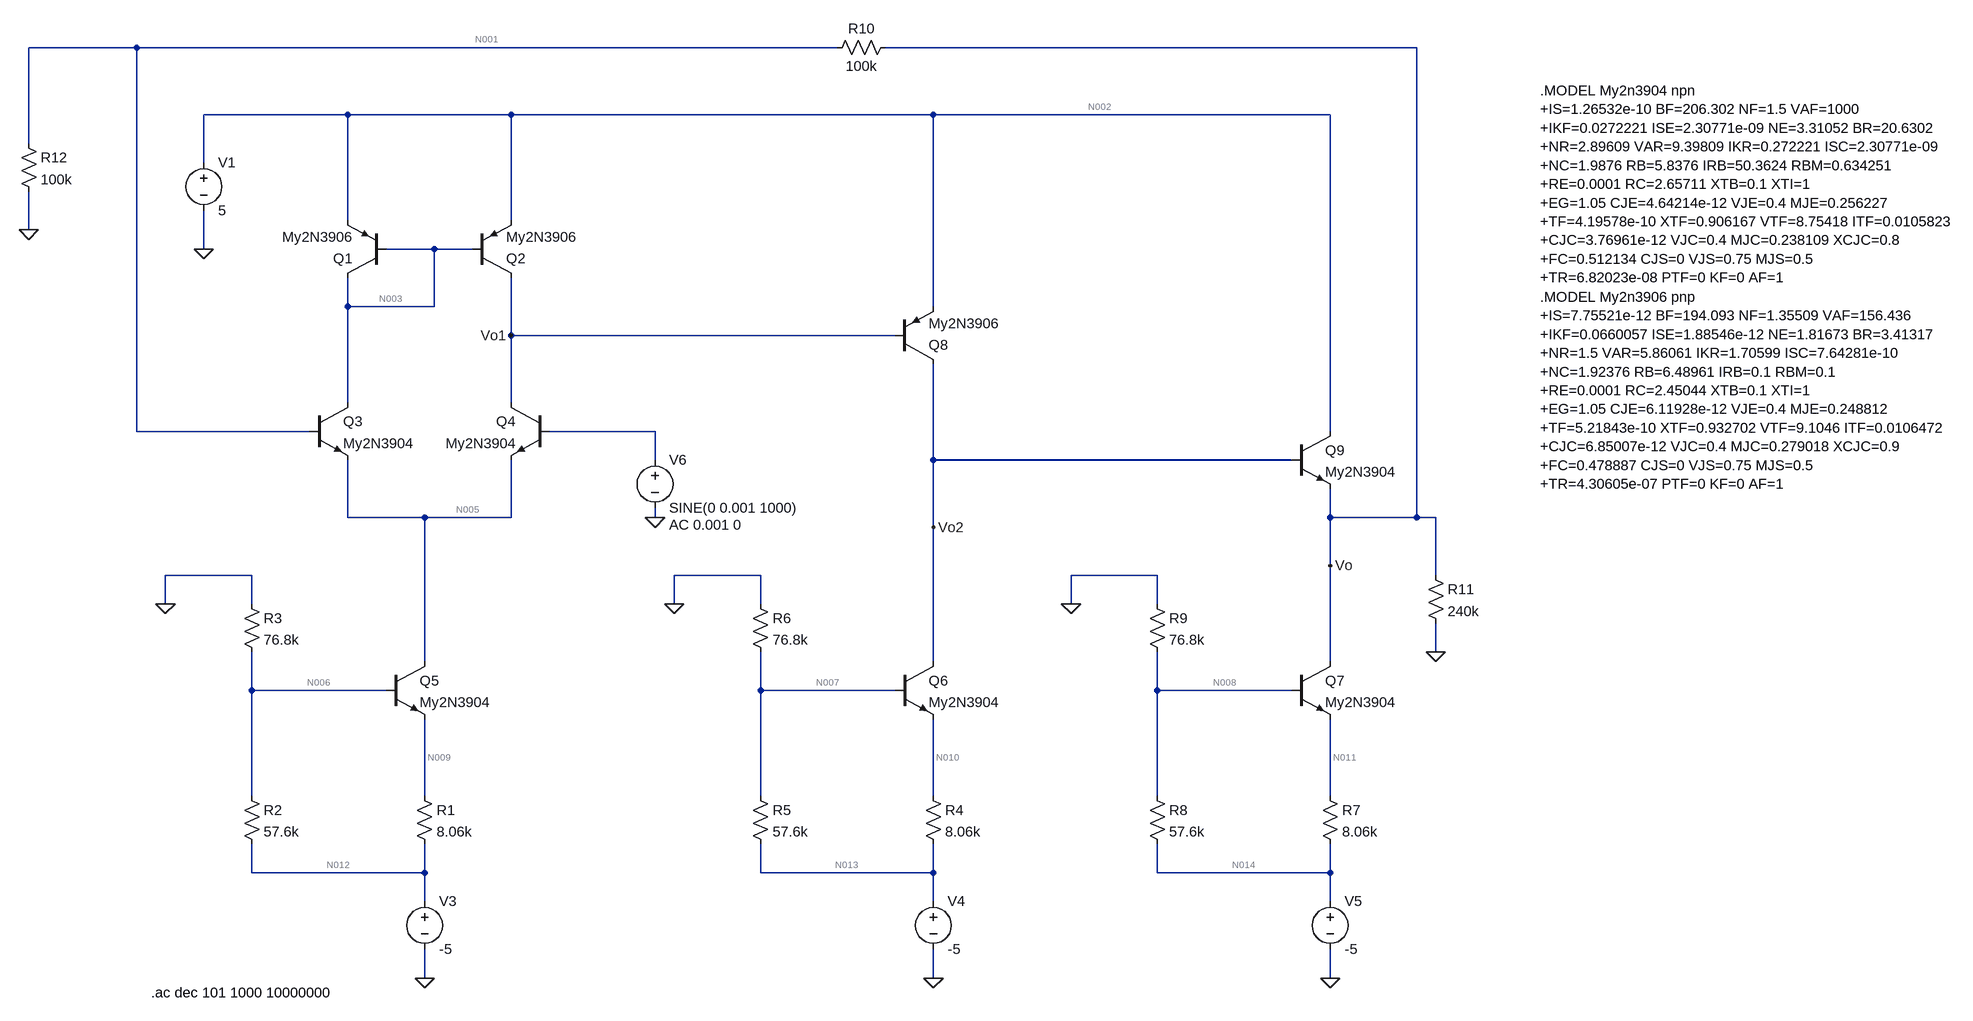
[diagram p0: schematic B.asc]
B.asc, the LTspice schematic file:
Version 4
SHEET 1 1872 872
WIRE -1376 -720 -1584 -720
WIRE -208 -720 -1376 -720
WIRE 864 -720 -128 -720
WIRE -1024 -608 -1264 -608
WIRE -752 -608 -1024 -608
WIRE -48 -608 -752 -608
WIRE 720 -608 -48 -608
WIRE -1584 -560 -1584 -720
WIRE -1264 -528 -1264 -608
WIRE -1024 -432 -1024 -608
WIRE -752 -432 -752 -608
WIRE -1584 -416 -1584 -480
WIRE -1264 -384 -1264 -448
WIRE -880 -384 -960 -384
WIRE -816 -384 -880 -384
WIRE -1024 -288 -1024 -336
WIRE -880 -288 -880 -384
WIRE -880 -288 -1024 -288
WIRE -48 -288 -48 -608
WIRE -752 -240 -752 -336
WIRE -112 -240 -752 -240
WIRE -1024 -128 -1024 -288
WIRE -752 -128 -752 -240
WIRE -1376 -80 -1376 -720
WIRE -1088 -80 -1376 -80
WIRE -512 -80 -688 -80
WIRE 720 -80 720 -608
WIRE -512 -32 -512 -80
WIRE -48 -32 -48 -192
WIRE 656 -32 -48 -32
WIRE -1024 64 -1024 -32
WIRE -896 64 -1024 64
WIRE -752 64 -752 -32
WIRE -752 64 -896 64
WIRE -512 64 -512 48
WIRE 720 64 720 16
WIRE 864 64 864 -720
WIRE 864 64 720 64
WIRE 896 64 864 64
WIRE -48 80 -48 -32
WIRE 720 144 720 64
WIRE -1184 160 -1328 160
WIRE -336 160 -480 160
WIRE 432 160 288 160
WIRE 896 160 896 64
WIRE -1328 208 -1328 160
WIRE -1184 208 -1184 160
WIRE -480 208 -480 160
WIRE -336 208 -336 160
WIRE 288 208 288 160
WIRE 432 208 432 160
WIRE 896 288 896 240
WIRE -896 304 -896 64
WIRE -48 304 -48 80
WIRE 720 304 720 144
WIRE -1184 352 -1184 288
WIRE -960 352 -1184 352
WIRE -336 352 -336 288
WIRE -112 352 -336 352
WIRE 432 352 432 288
WIRE 656 352 432 352
WIRE -1184 528 -1184 352
WIRE -896 528 -896 400
WIRE -336 528 -336 352
WIRE -48 528 -48 400
WIRE 432 528 432 352
WIRE 720 528 720 400
WIRE -1184 656 -1184 608
WIRE -896 656 -896 608
WIRE -896 656 -1184 656
WIRE -336 656 -336 608
WIRE -48 656 -48 608
WIRE -48 656 -336 656
WIRE 432 656 432 608
WIRE 720 656 720 608
WIRE 720 656 432 656
WIRE -896 704 -896 656
WIRE -48 704 -48 656
WIRE 720 704 720 656
WIRE -896 832 -896 784
WIRE -48 832 -48 784
WIRE 720 832 720 784
FLAG -1264 -384 0
FLAG -1328 208 0
FLAG -896 832 0
FLAG -480 208 0
FLAG -48 832 0
FLAG 288 208 0
FLAG 720 832 0
FLAG -512 64 0
FLAG 896 288 0
FLAG -752 -240 Vo1
FLAG -48 80 Vo2
FLAG 720 144 Vo
FLAG -1584 -416 0
SYMBOL voltage -1264 -544 R0
WINDOW 123 0 0 Left 0
WINDOW 39 0 0 Left 0
SYMATTR InstName V1
SYMATTR Value 5
SYMBOL pnp -960 -336 R180
SYMATTR InstName Q1
SYMATTR Value My2N3906
SYMBOL pnp -816 -336 M180
SYMATTR InstName Q2
SYMATTR Value My2N3906
SYMBOL npn -1088 -128 R0
SYMATTR InstName Q3
SYMATTR Value My2N3904
SYMBOL npn -688 -128 M0
SYMATTR InstName Q4
SYMATTR Value My2N3904
SYMBOL npn -960 304 R0
SYMATTR InstName Q5
SYMATTR Value My2N3904
SYMBOL res -912 512 R0
SYMATTR InstName R1
SYMATTR Value 8.06k
SYMBOL res -1200 512 R0
SYMATTR InstName R2
SYMATTR Value 57.6k
SYMBOL res -1200 192 R0
SYMATTR InstName R3
SYMATTR Value 76.8k
SYMBOL voltage -896 688 R0
WINDOW 123 0 0 Left 0
WINDOW 39 0 0 Left 0
SYMATTR InstName V3
SYMATTR Value -5
SYMBOL npn -112 304 R0
SYMATTR InstName Q6
SYMATTR Value My2N3904
SYMBOL res -64 512 R0
SYMATTR InstName R4
SYMATTR Value 8.06k
SYMBOL res -352 512 R0
SYMATTR InstName R5
SYMATTR Value 57.6k
SYMBOL res -352 192 R0
SYMATTR InstName R6
SYMATTR Value 76.8k
SYMBOL voltage -48 688 R0
WINDOW 123 0 0 Left 0
WINDOW 39 0 0 Left 0
SYMATTR InstName V4
SYMATTR Value -5
SYMBOL npn 656 304 R0
SYMATTR InstName Q7
SYMATTR Value My2N3904
SYMBOL res 704 512 R0
SYMATTR InstName R7
SYMATTR Value 8.06k
SYMBOL res 416 512 R0
SYMATTR InstName R8
SYMATTR Value 57.6k
SYMBOL res 416 192 R0
SYMATTR InstName R9
SYMATTR Value 76.8k
SYMBOL voltage 720 688 R0
WINDOW 123 0 0 Left 0
WINDOW 39 0 0 Left 0
SYMATTR InstName V5
SYMATTR Value -5
SYMBOL voltage -512 -48 R0
WINDOW 123 24 124 Left 2
WINDOW 39 0 0 Left 0
SYMATTR Value2 AC 0.001 0
SYMATTR InstName V6
SYMATTR Value SINE(0 0.001 1000)
SYMBOL pnp -112 -192 M180
SYMATTR InstName Q8
SYMATTR Value My2N3906
SYMBOL npn 656 -80 R0
SYMATTR InstName Q9
SYMATTR Value My2N3904
SYMBOL res -112 -736 R90
WINDOW 0 0 56 VBottom 2
WINDOW 3 32 56 VTop 2
SYMATTR InstName R10
SYMATTR Value 100k
SYMBOL res 880 144 R0
SYMATTR InstName R11
SYMATTR Value 240k
SYMBOL res -1600 -576 R0
SYMATTR InstName R12
SYMATTR Value 100k
TEXT 1128 -648 Left 2 !.MODEL My2n3904 npn\n+IS=1.26532e-10 BF=206.302 NF=1.5 VAF=1000\n+IKF=0.0272221 ISE=2.30771e-09 NE=3.31052 BR=20.6302\n+NR=2.89609 VAR=9.39809 IKR=0.272221 ISC=2.30771e-09\n+NC=1.9876 RB=5.8376 IRB=50.3624 RBM=0.634251\n+RE=0.0001 RC=2.65711 XTB=0.1 XTI=1\n+EG=1.05 CJE=4.64214e-12 VJE=0.4 MJE=0.256227\n+TF=4.19578e-10 XTF=0.906167 VTF=8.75418 ITF=0.0105823\n+CJC=3.76961e-12 VJC=0.4 MJC=0.238109 XCJC=0.8\n+FC=0.512134 CJS=0 VJS=0.75 MJS=0.5\n+TR=6.82023e-08 PTF=0 KF=0 AF=1
TEXT 1128 -304 Left 2 !.MODEL My2n3906 pnp\n+IS=7.75521e-12 BF=194.093 NF=1.35509 VAF=156.436\n+IKF=0.0660057 ISE=1.88546e-12 NE=1.81673 BR=3.41317\n+NR=1.5 VAR=5.86061 IKR=1.70599 ISC=7.64281e-10\n+NC=1.92376 RB=6.48961 IRB=0.1 RBM=0.1\n+RE=0.0001 RC=2.45044 XTB=0.1 XTI=1\n+EG=1.05 CJE=6.11928e-12 VJE=0.4 MJE=0.248812\n+TF=5.21843e-10 XTF=0.932702 VTF=9.1046 ITF=0.0106472\n+CJC=6.85007e-12 VJC=0.4 MJC=0.279018 XCJC=0.9\n+FC=0.478887 CJS=0 VJS=0.75 MJS=0.5\n+TR=4.30605e-07 PTF=0 KF=0 AF=1
TEXT -1352 856 Left 2 !.ac dec 101 1000 10000000

The netlist it stands for:
* B.asc
V1 N002 0 5
Q1 N003 N003 N002 0 My2N3906
Q2 Vo1 N003 N002 0 My2N3906
Q3 N003 N001 N005 0 My2N3904
Q4 Vo1 N004 N005 0 My2N3904
Q5 N005 N006 N009 0 My2N3904
R1 N009 N012 8.06k
R2 N006 N012 57.6k
R3 0 N006 76.8k
V3 N012 0 -5
Q6 Vo2 N007 N010 0 My2N3904
R4 N010 N013 8.06k
R5 N007 N013 57.6k
R6 0 N007 76.8k
V4 N013 0 -5
Q7 Vo N008 N011 0 My2N3904
R7 N011 N014 8.06k
R8 N008 N014 57.6k
R9 0 N008 76.8k
V5 N014 0 -5
V6 N004 0 SINE(0 0.001 1000) AC 0.001 0
Q8 Vo2 Vo1 N002 0 My2N3906
Q9 N002 Vo2 Vo 0 My2N3904
R10 Vo N001 100k
R11 Vo 0 240k
R12 N001 0 100k
.model NPN NPN
.model PNP PNP
.lib standard.bjt
.MODEL My2n3904 npn
+IS=1.26532e-10 BF=206.302 NF=1.5 VAF=1000
+IKF=0.0272221 ISE=2.30771e-09 NE=3.31052 BR=20.6302
+NR=2.89609 VAR=9.39809 IKR=0.272221 ISC=2.30771e-09
+NC=1.9876 RB=5.8376 IRB=50.3624 RBM=0.634251
+RE=0.0001 RC=2.65711 XTB=0.1 XTI=1
+EG=1.05 CJE=4.64214e-12 VJE=0.4 MJE=0.256227
+TF=4.19578e-10 XTF=0.906167 VTF=8.75418 ITF=0.0105823
+CJC=3.76961e-12 VJC=0.4 MJC=0.238109 XCJC=0.8
+FC=0.512134 CJS=0 VJS=0.75 MJS=0.5
+TR=6.82023e-08 PTF=0 KF=0 AF=1
.MODEL My2n3906 pnp
+IS=7.75521e-12 BF=194.093 NF=1.35509 VAF=156.436
+IKF=0.0660057 ISE=1.88546e-12 NE=1.81673 BR=3.41317
+NR=1.5 VAR=5.86061 IKR=1.70599 ISC=7.64281e-10
+NC=1.92376 RB=6.48961 IRB=0.1 RBM=0.1
+RE=0.0001 RC=2.45044 XTB=0.1 XTI=1
+EG=1.05 CJE=6.11928e-12 VJE=0.4 MJE=0.248812
+TF=5.21843e-10 XTF=0.932702 VTF=9.1046 ITF=0.0106472
+CJC=6.85007e-12 VJC=0.4 MJC=0.279018 XCJC=0.9
+FC=0.478887 CJS=0 VJS=0.75 MJS=0.5
+TR=4.30605e-07 PTF=0 KF=0 AF=1
.ac dec 101 1000 10000000
.backanno
.end

* Results of the author's LTspice run, read from the files saved beside the schematic
* Operating Point, zero values left out:
*   V(n002) = 5 V
*   V(n003) = 4.427 V
*   V(vo1) = 4.401 V
*   V(n001) = 25.25 µV
*   V(n005) = -525.4 mV
*   V(n006) = -2.937 V
*   V(n009) = -3.49 V
*   V(n012) = -5 V
*   V(vo2) = 706 mV
*   V(n007) = -2.937 V
*   V(n010) = -3.49 V
*   V(n013) = -5 V
*   V(vo) = 152.9 mV
*   V(n008) = -2.937 V
*   V(n011) = -3.49 V
*   V(n014) = -5 V
*   Ic(Q9) = 184.6 µA
*   Ib(Q9) = 2.423 µA
*   Ie(Q9) = -187 µA
*   Ic(Q7) = 184.9 µA
*   Ib(Q7) = 2.427 µA
*   Ie(Q7) = -187.3 µA
*   Ic(Q6) = 184.9 µA
*   Ib(Q6) = 2.427 µA
*   Ie(Q6) = -187.3 µA
*   Ic(Q5) = 184.9 µA
*   Ib(Q5) = 2.429 µA
*   Ie(Q5) = -187.3 µA
*   Ic(Q4) = 90.88 µA
*   Ib(Q4) = 1.527 µA
*   Ie(Q4) = -92.41 µA
*   Ic(Q3) = 90.94 µA
*   Ib(Q3) = 1.528 µA
*   Ie(Q3) = -92.47 µA
*   Ic(Q8) = -187.3 µA
*   Ib(Q8) = -1.695 µA
*   Ie(Q8) = 189 µA
*   Ic(Q2) = -89.18 µA
*   Ib(Q2) = -886.2 nA
*   Ie(Q2) = 90.07 µA
*   Ic(Q1) = -89.17 µA
*   Ib(Q1) = -886.5 nA
*   Ie(Q1) = 90.05 µA
*   I(R12) = 252.5 pA
*   I(R11) = 636.9 nA
*   I(R10) = 1.528 µA
*   I(R9) = 38.24 µA
*   I(R8) = 35.82 µA
*   I(R7) = 187.3 µA
*   I(R6) = 38.24 µA
*   I(R5) = 35.82 µA
*   I(R4) = 187.3 µA
*   I(R3) = 38.24 µA
*   I(R2) = 35.81 µA
*   I(R1) = 187.3 µA
*   I(V6) = -1.527 µA
*   I(V5) = 223.1 µA
*   I(V4) = 223.1 µA
*   I(V3) = 223.1 µA
*   I(V1) = -553.8 µA
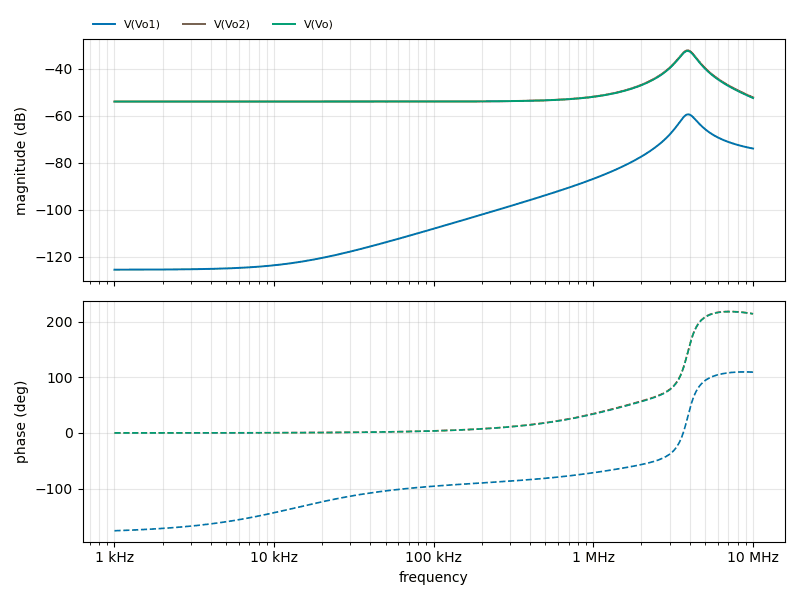
[diagram p1: AC Analysis of B.asc, plotted from the saved traces]
* AC Analysis, 1 run:
*   V(Vo1): -125.52 dB at 1 kHz, -73.97 dB at 10 MHz, peak -59.39 dB at 3.927 MHz, 3 dB below the peak at 3.496 MHz and 4.457 MHz
*   V(Vo2): -53.96 dB at 1 kHz, -52.21 dB at 10 MHz, peak -32.20 dB at 3.927 MHz, 3 dB below the peak at 3.442 MHz and 4.383 MHz
*   V(Vo): -53.98 dB at 1 kHz, -52.47 dB at 10 MHz, peak -32.42 dB at 3.927 MHz, 3 dB below the peak at 3.441 MHz and 4.382 MHz